# Altium project PCB_TDT4295_NTNU_2013.PrjPcb (part 2 of 2)

## Sheet decoupling.SchDoc
size A4
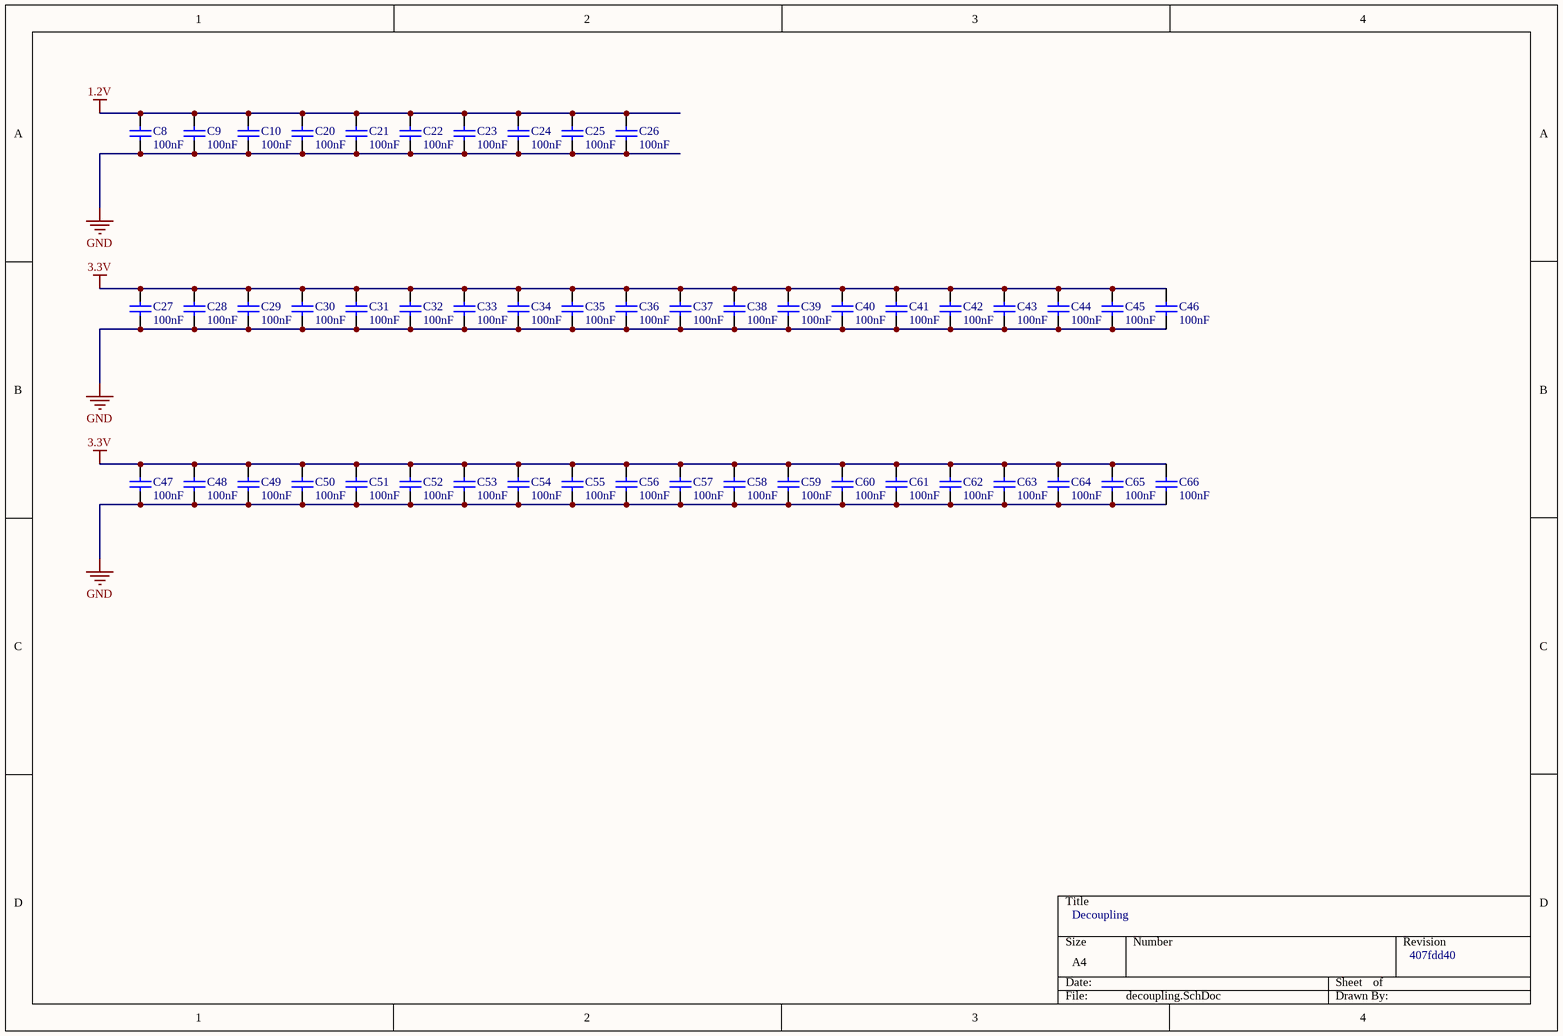
[diagram p16: decoupling.SchDoc]

### Parts
C8  value 100nF  [CAPC1210(3225)100_L]  (hidden comment: CAP 10pF 100V 1210(3225))
C9  value 100nF  [CAPC1210(3225)100_L]  (hidden comment: CAP 10pF 100V 1210(3225))
C10  value 100nF  [CAPC1210(3225)100_L]  (hidden comment: CAP 10pF 100V 1210(3225))
C20  value 100nF  [CAPC1210(3225)100_L]  (hidden comment: CAP 100nF 100V 1210(3225))
C21  value 100nF  [CAPC1210(3225)100_L]  (hidden comment: CAP 100nF 100V 1210(3225))
C22  value 100nF  [CAPC1210(3225)100_L]  (hidden comment: CAP 100nF 100V 1210(3225))
C23  value 100nF  [CAPC1210(3225)100_L]  (hidden comment: CAP 100nF 100V 1210(3225))
C24  value 100nF  [CAPC1210(3225)100_L]  (hidden comment: CAP 100nF 100V 1210(3225))
C25  value 100nF  [CAPC1210(3225)100_L]  (hidden comment: CAP 100nF 100V 1210(3225))
C26  value 100nF  [CAPC1210(3225)100_L]  (hidden comment: CAP 100nF 100V 1210(3225))
C27  value 100nF  [CAPC1210(3225)100_L]  (hidden comment: CAP 100nF 100V 1210(3225))
C28  value 100nF  [CAPC1210(3225)100_L]  (hidden comment: CAP 100nF 100V 1210(3225))
C29  value 100nF  [CAPC1210(3225)100_L]  (hidden comment: CAP 100nF 100V 1210(3225))
C30  value 100nF  [CAPC1210(3225)100_L]  (hidden comment: CAP 100nF 100V 1210(3225))
C31  value 100nF  [CAPC1210(3225)100_L]  (hidden comment: CAP 100nF 100V 1210(3225))
C32  value 100nF  [CAPC1210(3225)100_L]  (hidden comment: CAP 100nF 100V 1210(3225))
C33  value 100nF  [CAPC1210(3225)100_L]  (hidden comment: CAP 100nF 100V 1210(3225))
C34  value 100nF  [CAPC1210(3225)100_L]  (hidden comment: CAP 100nF 100V 1210(3225))
C35  value 100nF  [CAPC1210(3225)100_L]  (hidden comment: CAP 100nF 100V 1210(3225))
C36  value 100nF  [CAPC1210(3225)100_L]  (hidden comment: CAP 100nF 100V 1210(3225))
C37  value 100nF  [CAPC1210(3225)100_L]  (hidden comment: CAP 100nF 100V 1210(3225))
C38  value 100nF  [CAPC1210(3225)100_L]  (hidden comment: CAP 100nF 100V 1210(3225))
C39  value 100nF  [CAPC1210(3225)100_L]  (hidden comment: CAP 100nF 100V 1210(3225))
C40  value 100nF  [CAPC1210(3225)100_L]  (hidden comment: CAP 100nF 100V 1210(3225))
C41  value 100nF  [CAPC1210(3225)100_L]  (hidden comment: CAP 100nF 100V 1210(3225))
C42  value 100nF  [CAPC1210(3225)100_L]  (hidden comment: CAP 100nF 100V 1210(3225))
C43  value 100nF  [CAPC1210(3225)100_L]  (hidden comment: CAP 100nF 100V 1210(3225))
C44  value 100nF  [CAPC1210(3225)100_L]  (hidden comment: CAP 100nF 100V 1210(3225))
C45  value 100nF  [CAPC1210(3225)100_L]  (hidden comment: CAP 100nF 100V 1210(3225))
C46  value 100nF  [CAPC1210(3225)100_L]  (hidden comment: CAP 100nF 100V 1210(3225))
C47  value 100nF  [CAPC1210(3225)100_L]  (hidden comment: CAP 100nF 100V 1210(3225))
C48  value 100nF  [CAPC1210(3225)100_L]  (hidden comment: CAP 100nF 100V 1210(3225))
C49  value 100nF  [CAPC1210(3225)100_L]  (hidden comment: CAP 100nF 100V 1210(3225))
C50  value 100nF  [CAPC1210(3225)100_L]  (hidden comment: CAP 100nF 100V 1210(3225))
C51  value 100nF  [CAPC1210(3225)100_L]  (hidden comment: CAP 100nF 100V 1210(3225))
C52  value 100nF  [CAPC1210(3225)100_L]  (hidden comment: CAP 100nF 100V 1210(3225))
C53  value 100nF  [CAPC1210(3225)100_L]  (hidden comment: CAP 100nF 100V 1210(3225))
C54  value 100nF  [CAPC1210(3225)100_L]  (hidden comment: CAP 100nF 100V 1210(3225))
C55  value 100nF  [CAPC1210(3225)100_L]  (hidden comment: CAP 100nF 100V 1210(3225))
C56  value 100nF  [CAPC1210(3225)100_L]  (hidden comment: CAP 100nF 100V 1210(3225))
C57  value 100nF  [CAPC1210(3225)100_L]  (hidden comment: CAP 100nF 100V 1210(3225))
C58  value 100nF  [CAPC1210(3225)100_L]  (hidden comment: CAP 100nF 100V 1210(3225))
C59  value 100nF  [CAPC1210(3225)100_L]  (hidden comment: CAP 100nF 100V 1210(3225))
C60  value 100nF  [CAPC1210(3225)100_L]  (hidden comment: CAP 100nF 100V 1210(3225))
C61  value 100nF  [CAPC1210(3225)100_L]  (hidden comment: CAP 100nF 100V 1210(3225))
C62  value 100nF  [CAPC1210(3225)100_L]  (hidden comment: CAP 100nF 100V 1210(3225))
C63  value 100nF  [CAPC1210(3225)100_L]  (hidden comment: CAP 100nF 100V 1210(3225))
C64  value 100nF  [CAPC1210(3225)100_L]  (hidden comment: CAP 100nF 100V 1210(3225))
C65  value 100nF  [CAPC1210(3225)100_L]  (hidden comment: CAP 100nF 100V 1210(3225))
C66  value 100nF  [CAPC1210(3225)100_L]  (hidden comment: CAP 100nF 100V 1210(3225))

### Nets
1.2V: C8.1 C9.1 C10.1 C20.1 C21.1 C22.1 C23.1 C24.1 C25.1 C26.1
3.3V: C27.1 C28.1 C29.1 C30.1 C31.1 C32.1 C33.1 C34.1 C35.1 C36.1 C37.1 C38.1 C39.1 C40.1 C41.1 C42.1 C43.1 C44.1 C45.1 C46.1 C47.1 C48.1 C49.1 C50.1 C51.1 C52.1 C53.1 C54.1 C55.1 C56.1 C57.1 C58.1 C59.1 C60.1 C61.1 C62.1 C63.1 C64.1 C65.1 C66.1
GND: C8.2 C9.2 C10.2 C20.2 C21.2 C22.2 C23.2 C24.2 C25.2 C26.2 C27.2 C28.2 C29.2 C30.2 C31.2 C32.2 C33.2 C34.2 C35.2 C36.2 C37.2 C38.2 C39.2 C40.2 C41.2 C42.2 C43.2 C44.2 C45.2 C46.2 C47.2 C48.2 C49.2 C50.2 C51.2 C52.2 C53.2 C54.2 C55.2 C56.2 C57.2 C58.2 C59.2 C60.2 C61.2 C62.2 C63.2 C64.2 C65.2 C66.2

### Notes on the sheet
- Decoupling
- 407fdd40

### Library data of the parts
C8-C10 C20-C66 = CMP-1038-00005-1: CAP 100nF 100V ±0.25pF 1210 (3225 Metric) Thickness 1mm SMD; Case-Metric: 3225; Case-EIA: 1210; Max Thickness: 1 mm; Rated Voltage: 100 V; Technology: SMT; Tolerance: ±0.25pF

## Nets that join several sheets
1.2V: power_supply (6 pins), FPGA (11 pins), headers (POWER_H.2 POWER_H.4), decoupling (10 pins)
3.3V: power_supply (6 pins), serial_port (E4.2), IMEM0 (MEM_IMEM0.11 MEM_IMEM0.33), IMEM1 (MEM_IMEM1.11 MEM_IMEM1.33), DMEM (MEM_DMEM.11 MEM_DMEM.33), microcontroller (10 pins), microcontroller_reset_button (RESET_SW.3 RESET_SW.4), FPGA (39 pins), sdsheet (SD1.4 SD1.11), headers (POWER_H.6 POWER_H.8 POWER_H.10 POWER_H.12), oscillator (OSC.1 OSC.4), leds_logo (R20.1 R21.1), decoupling (40 pins)
12.0V: power_supply (PW_H2.1 PW_H4.1), psu_toggle_switch (PSU_H.3), headers (POWER_H.11)
GND: power_supply (18 pins), leds (16 pins), buttons (16 pins), serial_port (10 pins), IMEM0 (MEM_IMEM0.12 MEM_IMEM0.34 MEM_IMEM0.41), IMEM1 (MEM_IMEM1.12 MEM_IMEM1.34 MEM_IMEM1.41), DMEM (MEM_DMEM.12 MEM_DMEM.34 MEM_DMEM.41), microcontroller (15 pins), FPGA (39 pins), USBdevice (J1.5 USB_D.2), sdsheet (5 pins), headers (7 pins), crystal (C14.2 C15.1), oscillator (OSC.2), leds_logo (LED21.2 LED22.2), decoupling (50 pins)
CLK: FPGA (FPGA.D9 FPGA.R10), oscillator (OSC.3)
FPGA_HEADER0: FPGA (FPGA.D4), headers (FPGA_H_A.1)
FPGA_HEADER1: FPGA (FPGA.C4), headers (FPGA_H_A.2)
FPGA_HEADER2: FPGA (FPGA.A6), headers (FPGA_H_A.3)
FPGA_HEADER3: FPGA (FPGA.C9), headers (FPGA_H_A.4)
FPGA_HEADER4: FPGA (FPGA.B9), headers (FPGA_H_A.5)
FPGA_HEADER5: FPGA (FPGA.A9), headers (FPGA_H_A.6)
FPGA_HEADER6: FPGA (FPGA.D11), headers (FPGA_H_A.7)
FPGA_HEADER7: FPGA (FPGA.C11), headers (FPGA_H_A.8)
FPGA_HEADER8: FPGA (FPGA.C10), headers (FPGA_H_A.9)
FPGA_HEADER9: FPGA (FPGA.A10), headers (FPGA_H_A.10)
FPGA_HEADER10: FPGA (FPGA.F9), headers (FPGA_H_A.11)
FPGA_HEADER11: FPGA (FPGA.B12), headers (FPGA_H_A.12)
FPGA_HEADER12: FPGA (FPGA.A12), headers (FPGA_H_A.13)
FPGA_HEADER13: FPGA (FPGA.C13), headers (FPGA_H_A.14)
FPGA_HEADER14: FPGA (FPGA.A13), headers (FPGA_H_A.15)
FPGA_HEADER15: FPGA (FPGA.B14), headers (FPGA_H_A.16)
FPGA_HEADER16: FPGA (FPGA.A14), headers (FPGA_H_A.17)
FPGA_HEADER17: FPGA (FPGA.F13), headers (FPGA_H_A.18)
FPGA_HEADER18: FPGA (FPGA.E13), headers (FPGA_H_A.19)
FPGA_HEADER19: FPGA (FPGA.C15), headers (FPGA_H_A.20)
FPGA_HEADER20: FPGA (FPGA.A15), headers (FPGA_H_A.21)
FPGA_HEADER21: FPGA (FPGA.D14), headers (FPGA_H_A.22)
FPGA_HEADER22: FPGA (FPGA.C14), headers (FPGA_H_A.23)
FPGA_HEADER23: FPGA (FPGA.B16), headers (FPGA_H_A.24)
FPGA_HEADER24: FPGA (FPGA.A16), headers (FPGA_H_A.25)
FPGA_HEADER28: FPGA (FPGA.R15), headers (FPGA_H_A.29)
FPGA_HEADER29: FPGA (FPGA.T15), headers (FPGA_H_A.30)
FPGA_HEADER30: FPGA (FPGA.U16), headers (FPGA_H_A.31)
FPGA_HEADER31: FPGA (FPGA.V16), headers (FPGA_H_A.32)
FPGA_HEADER32: FPGA (FPGA.R13), headers (FPGA_H_A.33)
FPGA_HEADER33: FPGA (FPGA.T13), headers (FPGA_H_A.34)
FPGA_HEADER34: FPGA (FPGA.T14), headers (FPGA_H_A.35)
FPGA_HEADER35: FPGA (FPGA.V14), headers (FPGA_H_A.36)
FPGA_HEADER36: FPGA (FPGA.N12), headers (FPGA_H_A.37)
FPGA_HEADER37: FPGA (FPGA.P12), headers (FPGA_H_A.38)
FPGA_HEADER38: FPGA (FPGA.U13), headers (FPGA_H_A.39)
FPGA_HEADER39: FPGA (FPGA.V13), headers (FPGA_H_A.40)
FPGA_HEADER40: FPGA (FPGA.T11), headers (FPGA_H_B.1)
FPGA_HEADER41: FPGA (FPGA.T10), headers (FPGA_H_B.2)
FPGA_HEADER42: FPGA (FPGA.U10), headers (FPGA_H_B.3)
FPGA_HEADER43: FPGA (FPGA.V10), headers (FPGA_H_B.4)
FPGA_HEADER44: FPGA (FPGA.R8), headers (FPGA_H_B.5)
FPGA_HEADER45: FPGA (FPGA.T8), headers (FPGA_H_B.6)
FPGA_HEADER46: FPGA (FPGA.T9), headers (FPGA_H_B.7)
FPGA_HEADER47: FPGA (FPGA.V9), headers (FPGA_H_B.8)
FPGA_HEADER48: FPGA (FPGA.V8), headers (FPGA_H_B.9)
FPGA_HEADER49: FPGA (FPGA.V6), headers (FPGA_H_B.10)
FPGA_HEADER50: FPGA (FPGA.R7), headers (FPGA_H_B.11)
FPGA_HEADER51: FPGA (FPGA.T7), headers (FPGA_H_B.12)
FPGA_HEADER52: FPGA (FPGA.N6), headers (FPGA_H_B.13)
FPGA_HEADER53: FPGA (FPGA.P7), headers (FPGA_H_B.14)
FPGA_HEADER54: FPGA (FPGA.R5), headers (FPGA_H_B.15)
FPGA_HEADER55: FPGA (FPGA.T5), headers (FPGA_H_B.16)
FPGA_HEADER56: FPGA (FPGA.U5), headers (FPGA_H_B.17)
FPGA_HEADER57: FPGA (FPGA.V5), headers (FPGA_H_B.18)
FPGA_HEADER58: FPGA (FPGA.R3), headers (FPGA_H_B.19)
FPGA_HEADER59: FPGA (FPGA.T3), headers (FPGA_H_B.20)
FPGA_HEADER60: FPGA (FPGA.T4), headers (FPGA_H_B.21)
FPGA_HEADER61: FPGA (FPGA.V4), headers (FPGA_H_B.22)
FPGA_HEADER62: FPGA (FPGA.N5), headers (FPGA_H_B.23)
FPGA_HEADER64: FPGA (FPGA.V3), headers (FPGA_H_B.25)
FPGA_HEADER66: FPGA (FPGA.F2), headers (FPGA_H_B.27)
FPGA_HEADER67: FPGA (FPGA.F1), headers (FPGA_H_B.28)
FPGA_HEADER68: FPGA (FPGA.H6), headers (FPGA_H_B.29)
FPGA_HEADER69: FPGA (FPGA.H5), headers (FPGA_H_B.30)
FPGA_HEADER70: FPGA (FPGA.E3), headers (FPGA_H_B.31)
FPGA_HEADER71: FPGA (FPGA.E1), headers (FPGA_H_B.32)
FPGA_HEADER72: FPGA (FPGA.F4), headers (FPGA_H_B.33)
FPGA_HEADER73: FPGA (FPGA.F3), headers (FPGA_H_B.34)
FPGA_HEADER74: FPGA (FPGA.D2), headers (FPGA_H_B.35)
FPGA_HEADER75: FPGA (FPGA.D1), headers (FPGA_H_B.36)
FPGA_HEADER76: FPGA (FPGA.H7), headers (FPGA_H_B.37)
FPGA_HEADER77: FPGA (FPGA.G6), headers (FPGA_H_B.38)
FPGA_HEADER78: FPGA (FPGA.E4), headers (FPGA_H_B.39)
FPGA_HEADER79: FPGA (FPGA.D3), headers (FPGA_H_B.40)
FPGA_HEADER80: FPGA (FPGA.F6), headers (FPGA_H_C.1)
FPGA_HEADER81: FPGA (FPGA.F5), headers (FPGA_H_C.2)
FPGA_HEADER82: FPGA (FPGA.C2), headers (FPGA_H_C.3)
LED0: leds (R4.1), microcontroller (SCU_LED_H.2)
LED1: leds (R5.1), microcontroller (SCU_LED_H.4)
LED2: leds (R6.1), microcontroller (SCU_LED_H.6)
LED3: leds (R7.1), microcontroller (SCU_LED_H.8)
LED4: leds (R8.1), microcontroller (SCU_LED_H.10)
LED5: leds (R9.1), microcontroller (SCU_LED_H.12)
LED6: leds (R10.1), microcontroller (SCU_LED_H.14)
LED7: leds (R11.1), microcontroller (SCU_LED_H.16)
LED8: leds (R12.1), microcontroller (SCU_LED_H.18)
LED9: leds (R13.1), microcontroller (SCU_LED_H.20)
LED10: leds (R14.1), microcontroller (SCU_LED_H.22)
LED11: leds (R15.1), microcontroller (SCU_LED_H.24)
LED12: leds (R16.1), microcontroller (SCU_LED_H.26)
LED13: leds (R17.1), microcontroller (SCU_LED_H.28)
LED14: leds (R18.1), microcontroller (SCU_LED_H.30)
LED15: leds (R19.1), microcontroller (SCU_LED_H.32)
RESETn: microcontroller (SCU.K6), microcontroller_reset_button (RESET_SW.1 RESET_SW.2)
SW0: buttons (SW1.1 SW1.2), microcontroller (SCU_SW_H.2)
SW1: buttons (SW2.1 SW2.2), microcontroller (SCU_SW_H.4)
SW2: buttons (SW3.1 SW3.2), microcontroller (SCU_SW_H.6)
SW3: buttons (SW4.1 SW4.2), microcontroller (SCU_SW_H.8)
SW4: buttons (SW5.1 SW5.2), microcontroller (SCU_SW_H.10)
SW5: buttons (SW6.1 SW6.2), microcontroller (SCU_SW_H.12)
SW6: buttons (SW7.1 SW7.2), microcontroller (SCU_SW_H.14)
SW7: buttons (SW8.1 SW8.2), microcontroller (SCU_SW_H.16)
Toggle out: power_supply (6 pins), psu_toggle_switch (PSU_H.1)